# Altium schematic sheet PWR12V15A.SchDoc
size 381 x 241 mm; SheetNumber: 1; SheetTotal: 1
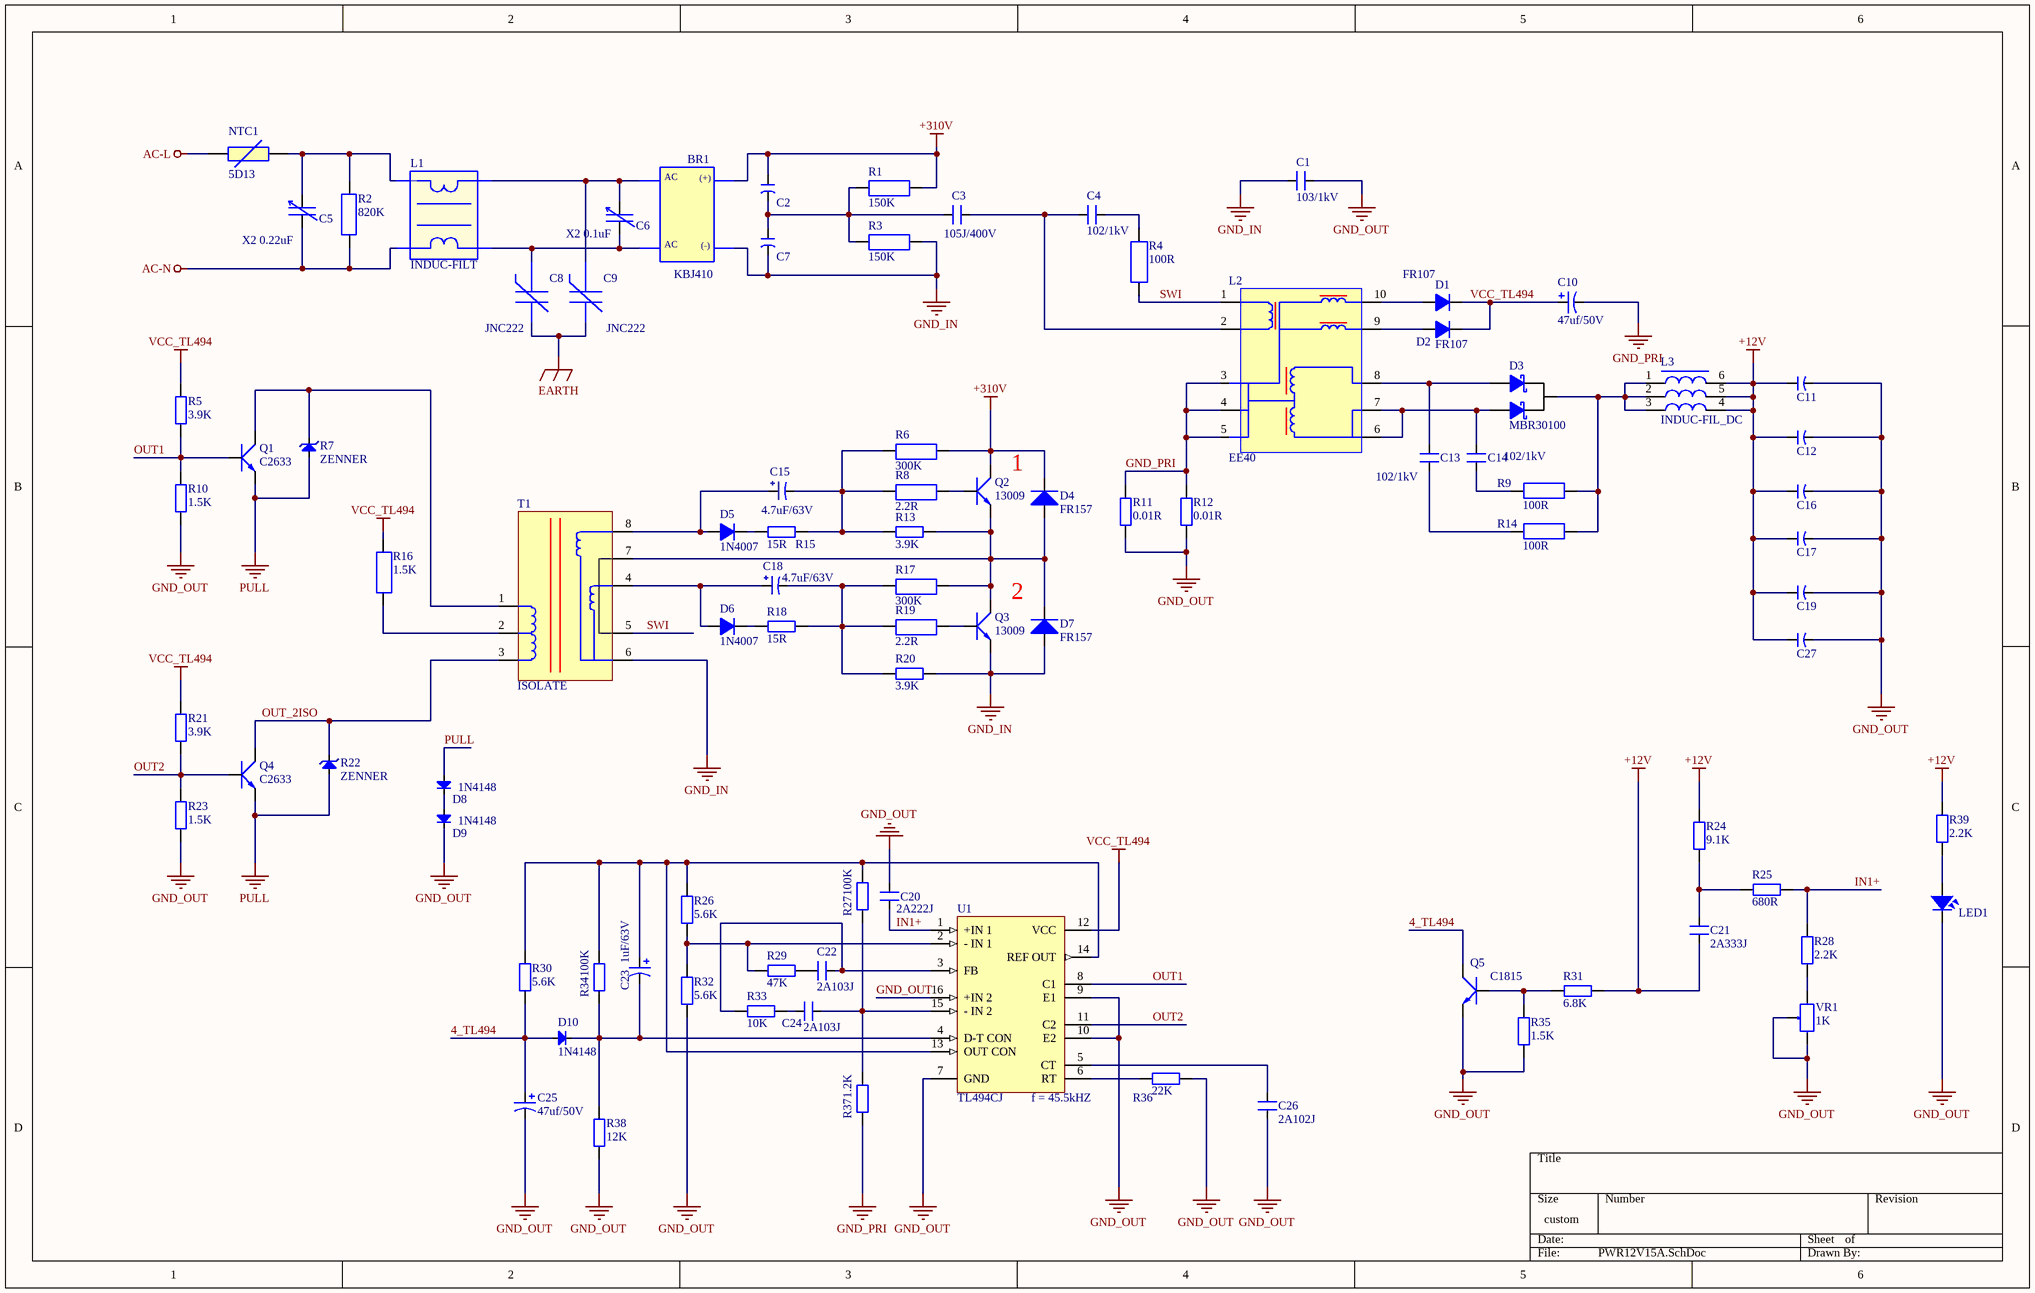
[diagram p0: PWR12V15A.SchDoc]

## Parts
BR1  KBJ410  [KDJ410]
C1  103/1kV  [JY103M_2KV]
C2  220uF/250V  [CAP-8MM]  (value not drawn)
C3  105J/400V  [CAP-POLY-22mm]
C4  102/1kV  [JY103M_2KV]
C5  X2 0.22uF  [X2 0.22uF]
C6  X2 0.1uF  [X2 0.1uF]
C7  220uF/250V  [CAP-8MM]  (value not drawn)
C8  JNC222  [MOV-14D]
C9  JNC222  [MOV-14D]
C10  47uf/50V  [C6mm]
C11  1000uF/16V  [CAP-5MM]  (value not drawn)
C12  1000uF/16V  [CAP-5MM]  (value not drawn)
C13  102/1kV  [JY103M_2KV]
C14  102/1kV  [JY103M_2KV]
C15  4.7uF/63V  [CA-ALU-8R]
C16  1000uF/16V  [CAP-5MM]  (value not drawn)
C17  1000uF/16V  [CAP-5MM]  (value not drawn)
C18  4.7uF/63V  [CA-ALU-8R]
C19  1000uF/16V  [CAP-5MM]  (value not drawn)
C20  2A222J  [CN1]
C21  2A333J  [CN1]
C22  2A103J  [CN1]
C23  1uF/63V  [C5mm]
C24  2A103J  [CN1]
C25  47uf/50V  [C6mm]
C26  2A102J  [CN1]
C27  1000uF/16V  [CAP-5MM]  (value not drawn)
D1  FR107  [DO41-1A]
D2  FR107  [DO41-1A]
D3  MBR30100  [QTO-220H3]
D4  FR157  [D2A]
D5  1N4007  [DO41-1A]
D6  1N4007  [DO41-1A]
D7  FR157  [D2A]
D8  1N4148  [DIO-2A]
D9  1N4148  [DIO-2A]
D10  1N4148  [DIO-2A]
L1  INDUC-FILT  [LF]
L2  EE40  [TRANSFOMER]
L3  INDUC-FIL_DC  [INDUCFIL_DC]
LED1  LED  [LED-5-BLUE]  (value not drawn)
NTC1  5D13  [XD-13]
Q1  C2633  [TO92-123]
Q2  13009  [QTO-220]
Q3  13009  [QTO-220]
Q4  C2633  [TO92-123]
Q5  C1815  [TO92-123]
R1  150K  [R1W]
R2  820K  [R1W]
R3  150K  [R1W]
R4  100R  [R2W]
R5  3.9K  [R1/2W]
R6  300K  [R1W]
R7  ZENNER  [DIO-2A-ZEN]
R8  2.2R  [R1W]
R9  100R  [R1W]
R10  1.5K  [R1/2W]
R11  0.01R  [R1/2W]
R12  0.01R  [R1/2W]
R13  3.9K  [R1/2W]
R14  100R  [R1W]
R15  15R  [R1/2W]
R16  1.5K  [R1W]
R17  300K  [R1W]
R18  15R  [R1/2W]
R19  2.2R  [R1W]
R20  3.9K  [R1/2W]
R21  3.9K  [R1/2W]
R22  ZENNER  [DIO-2A-ZEN]
R23  1.5K  [R1/2W]
R24  9.1K  [R1/2W]
R25  680R  [R1/2W]
R26  5.6K  [R1/2W]
R27  100K  [R1/2W]
R28  2.2K  [R1/2W]
R29  47K  [R1/2W]
R30  5.6K  [R1/2W]
R31  6.8K  [R1/2W]
R32  5.6K  [R1/2W]
R33  10K  [R1/2W]
R34  100K  [R1/2W]
R35  1.5K  [R1/2W]
R36  22K  [R1/2W]
R37  1.2K  [R1/2W]
R38  12K  [R1/2W]
R39  2.2K  [R1/2W]
T1  ISOLATE  [TRANFOMER_ISOLATE]
U1  TL494CJ  [DIP16]
VR1  1K  [VR]

## Nets
+12V: C11.1 C12.1 C16.1 C17.1 C19.1 C21.1 C27.1 L3.4 L3.5 L3.6 R24.2 R31.2 R39.1
+310V: BR1.1 C2.1 D4.2(K) Q2.2(C) R1.1 R6.1
AC-L: NTC1.1
AC-N: C5.1 L1.3 R2.1
EARTH: C8.1 C9.1
GND_IN: BR1.4 C1.1 C7.2 D7.1(A) Q3.3(E) R3.1 R20.2 T1.6
GND_OUT: C1.2 C11.2 C12.2 C16.2 C17.2 C19.2 C20.1 C25.2 C26.1 C27.2 D9.2(K) LED1.2 Q5.1(E) R10.1 R11.1 R12.1 R23.1 R32.1 R35.2 R36.1 R38.2 U1.7(GND) U1.9(E1) U1.10(E2) U1.16(+IN_2) VR1.1 VR1.2
GND_PRI: C10.2 L2.3 L2.4 L2.5 R11.2 R12.2 R37.2
PULL: D8.1(A) Q1.1(E) Q4.1(E) R7.1(A) R22.1(A)
VCC_TL494: C10.1 D1.2 D2.2 R5.2 R16.1 R21.2 U1.12(VCC)
4_TL494: C25.1 D10.1(A) Q5.2(C) R30.2
IN1+: C20.2 R25.1 R28.1 U1.1(+IN_1)
OUT1: Q1.3(B) R5.1 R10.2 U1.8(C1)
OUT2: Q4.3(B) R21.1 R23.2 U1.11(C2)
OUT_2ISO: Q4.2(C) R22.2(K) T1.3
SWI: L2.1 R4.2 T1.5
NetBR1_2: BR1.2 C6.2 C9.2 L1.2
NetBR1_3: BR1.3 C6.1 C8.2 L1.4
NetC2_2: C2.2 C3.1 C7.1 R1.2 R3.2
NetC3_2: C3.2 C4.1 L2.2
NetC4_2: C4.2 R4.1
NetC5_2: C5.2 L1.1 NTC1.2 R2.2
NetC13_1: C13.1 R14.1
NetC13_2: C13.2 D3.3 L2.8
NetC14_1: C14.1 R9.1
NetC14_2: C14.2 D3.1 L2.6 L2.7
NetC15_1: C15.1 D5.1 T1.8
NetC15_2: C15.2 R6.2 R8.2 R13.1 R15.2
NetC18_1: C18.1 D6.1 T1.4
NetC18_2: C18.2 R17.2 R18.2 R19.2 R20.1
NetC21_2: C21.2 R24.1 R25.2
NetC22_1: C22.1 R33.1 U1.3(FB)
NetC22_2: C22.2 R29.1
NetC23_1: C23.1 R26.1 R27.1 R30.1 R34.1 U1.13(OUT_CON) U1.14(REF_OUT)
NetC23_2: C23.2 D10.2(K) R34.2 R38.1 U1.4(D-T_CON)
NetC24_1: C24.1 R33.2
NetC24_2: C24.2 R27.2 R37.1 U1.15(-_IN_2)
NetC26_2: C26.2 U1.5(CT)
NetD1_1: D1.1 L2.10
NetD2_1: D2.1 L2.9
NetD3_2: D3.2 L3.1 L3.2 L3.3 R9.2 R14.2
NetD4_1: D4.1(A) D7.2(K) Q2.3(E) Q3.2(C) R13.2 R17.1 T1.7
NetD5_2: D5.2 R15.1
NetD6_2: D6.2 R18.1
NetD8_2: D8.2(K) D9.1(A)
NetLED1_1: LED1.1 R39.2
NetQ1_2: Q1.2(C) R7.2(K) T1.1
NetQ2_1: Q2.1(B) R8.1
NetQ3_1: Q3.1(B) R19.1
NetQ5_3: Q5.3(B) R31.1 R35.1
NetR16_2: R16.2 T1.2
NetR26_2: R26.2 R29.2 R32.2 U1.2(-_IN_1)
NetR28_2: R28.2 VR1.3
NetR36_2: R36.2 U1.6(RT)

## Notes on the sheet
- 1
- 2
- (near U1) f = 45.5kHZ
- (in symbol DIODE-BRIDGE) AC; (+); (-)

## Library data of the parts
BR1 = DIODE-BRIDGE
C1 C4 C13 C14 = CAP: Cap often used
C2 C7 C11 C12 C16 C17 C19 C27 = CAP-ELEC
C3 = CAP-POLY
C5 C6 = CAP_MKP
C8 C9 = MOV
C10 C23 C25 = CAP-Radial: Published: 8-Jun-2000; LatestRevisionDate: 17-Jul-2002; LatestRevisionNote: Re-released for DXP Platform.; PackageReference: POLAR0.8; Publisher: Altium Limited; value: ?
C15 C18 = CAP-ALU-DIP: Value: 104; LatestRevisionDate: 17-Jul-2002; LatestRevisionNote: Re-released for DXP Platform.; PackageReference: C1206; Publisher: Altium Limited
C20-C22 C24 C26 = CAP-gom: Value: 33pF
D1 D2 = Diode  1N4007: Diode 1A; Value: 1N4007
D3 = MBRF20200C: DIODE Schottky Barrier / Power / RECTIFIERS / 20 AMPERES / 200 VOLTS
D4 D7 = Diode Normal: Published: 8-Jun-2000; LatestRevisionDate: 17-Jul-2002; LatestRevisionNote: Re-released for DXP Platform.; DatasheetDocument: 1997; PackageReference: DO-35; Publisher: Altium Limited; Code_JEDEC: DO-204-AH; ComponentLink1Description: Manufacturer Link; ComponentLink1URL: http://www.fairchildsemi.com/; ComponentLink2Description: Datasheet; ComponentLink2URL: http://www.fairchildsemi.com/ds/1N%2F1N4448.pdf
D5 D6 = Diode  1N4007: Diode 1A; Value: 1N4007
D8-D10 = Diode: Default Diode; Code - JEDEC: DO-214-AB; Value: 1N5007; Published: 8-Jun-2000; Revision: July-2002: Re-released for DXP Platform.; Publisher: Altium Limited
L2 = TRANSFOMER
LED1 = LED: LED Single colour Green and Red; Value: LED 3 ly Single Colour
NTC1 = NTC
Q1 Q4 = 2SC1815: NPN 600mW, ECB; Value: C1815
Q2 Q3 = NPN_BCE: P 1W, BCE; Value: TIP41
Q5 = 2SC1815: NPN 600mW, ECB; Value: C1815
R1-R3 R6 R8 R9 R14 R16 R17 R19 = R1W: Resistor 1W; Value: R1W - 100
R4 = R2W: Resistor 2W; Value: R2W - 47
R5 R10-R13 R15 R18 R20 R21 R23-R39 = R1/4W: Resistor 1/4W; Value: R1/4W - 1K
R7 R22 = DIODE Zener
T1 = TRANSFOMER-ISOLATE
U1 = TL494CJ: Pulse-Width-Modulation Control Circuit; Published: 15-Apr-2002; LatestRevisionDate: 06-Jun-2005; LatestRevisionNote: Stylized 3D Model Added.; DatasheetVersion: Oct-1988; PackageVersion: Jun-1999; PackageReference: J016; Publisher: Altium Limited; PackageDescription: DIP; 16 Leads; Row Spacing 7.62 mm; Pitch 2.54 mm; ComponentLink1Description: Manufacturer Link; ComponentLink1URL: http://www.ti.com/
VR1 = VR: Var Resistor; Value: VR 10K